# EAGLE design passive_A-B_box (EAGLE 6.2)
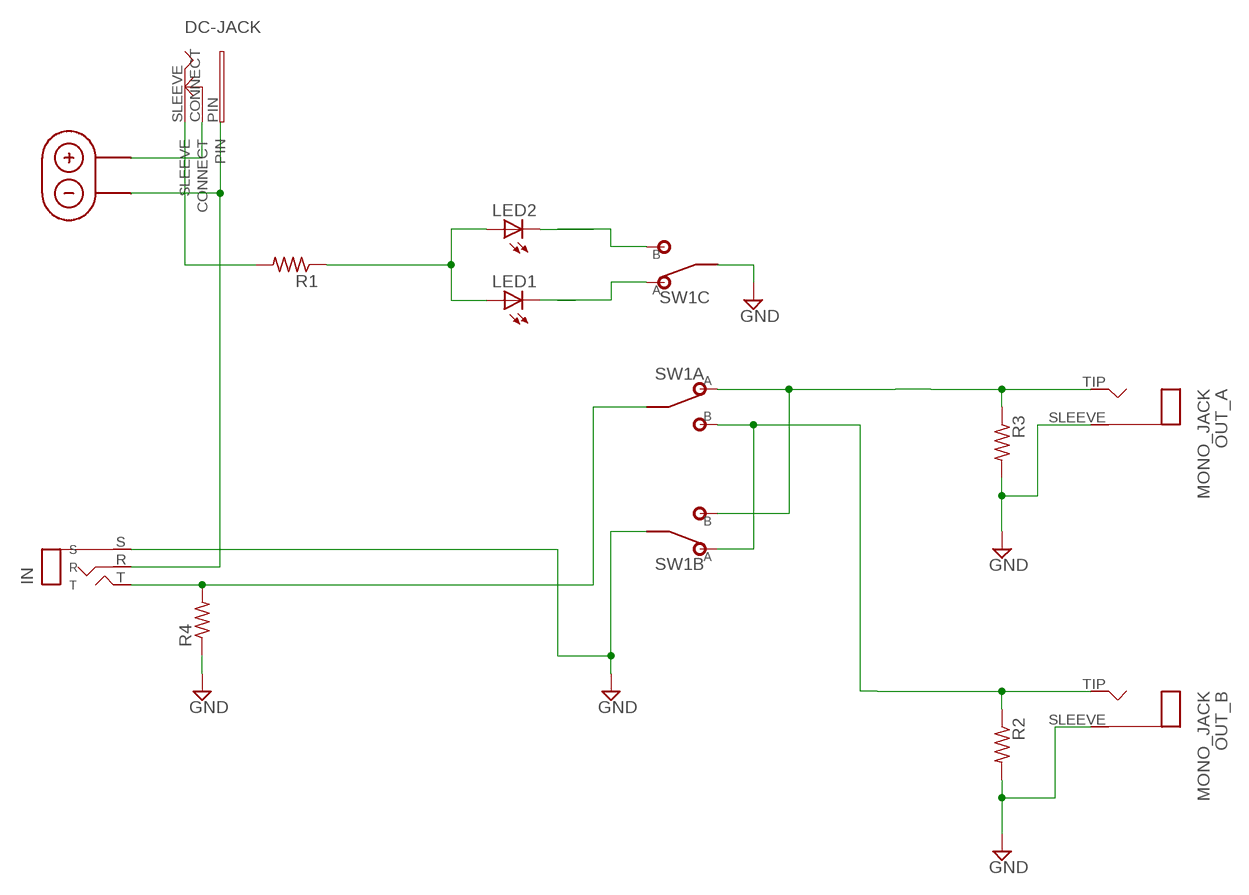
[diagram p0: schematic, sheet 1]

## Parts
DC-JACK  DC_JACK  DC_JACK_OFFBOARD  [DC_JACK_OFFBOARD]
IN  STEREO_JACK  [STEREO_JACK]
LED1  LED5MM  [LED5MM]
LED2  LED5MM  [LED5MM]
OUT_A  MONO_JACK  [MONO_JACK]
OUT_B  MONO_JACK  [MONO_JACK]
R1  RESISTOR  [RESISTOR]
R2  RESISTOR  [RESISTOR]
R3  RESISTOR  [RESISTOR]
R4  RESISTOR  [RESISTOR]
SW1  3PDT  [3PDT]
U$4  9V_BATTERY_CLIP  [9V_BATTERY]

## Nets
DC-JACK: DC-JACK.CONNECT U$4.9V_BATTERY_+
GND: IN.S OUT_A.SLEEVE OUT_B.SLEEVE R2.2 R3.2 R4.1 SW1.B2(B:COM) SW1.C2(C:COM)
N$1: IN.T R4.2 SW1.A2(A:COM)
N$4: DC-JACK.SLEEVE R1.2
N$5: LED1.K(C) SW1.C1(C:A)
N$7: LED2.K(C) SW1.C3(C:B)
N$8: LED1.A LED2.A R1.1
N$9: OUT_A.TIP R3.1 SW1.A1(A:A) SW1.B3(B:B)
N$10: OUT_B.TIP R2.1 SW1.A3(A:B) SW1.B1(B:A)
N$12: DC-JACK.PIN IN.R U$4.9V_BATTERY_-

## Library data of the parts
DC-JACK = 00_steve:DC_JACK_OFFBOARD
IN = 00_steve:STEREO_JACK
LED1 LED2 = SparkFun:LED: LEDs Standard schematic elements and footprints for 5mm, 3mm, 1206, and 0603 sized LEDs. 5mm - Spark Fun Electronics SKU : COM-00529 (and others)
OUT_A OUT_B = 00_steve:MONO_JACK
R1-R4 = 00_steve:RESISTOR
SW1 = 00_steve:3PDT
U$4 = 00_steve:9V_BATTERY_CLIP

## Board
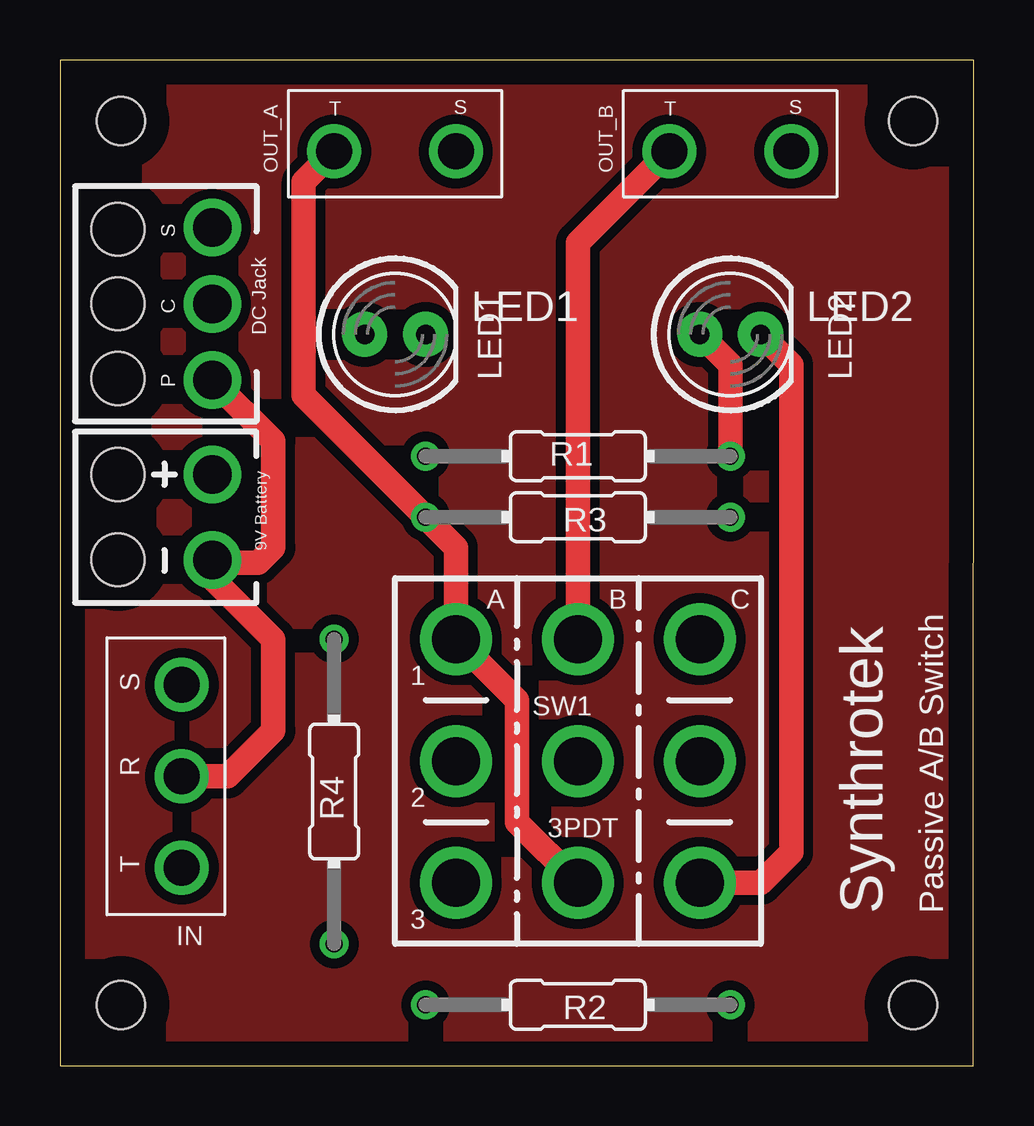
[diagram p1: board, top side]
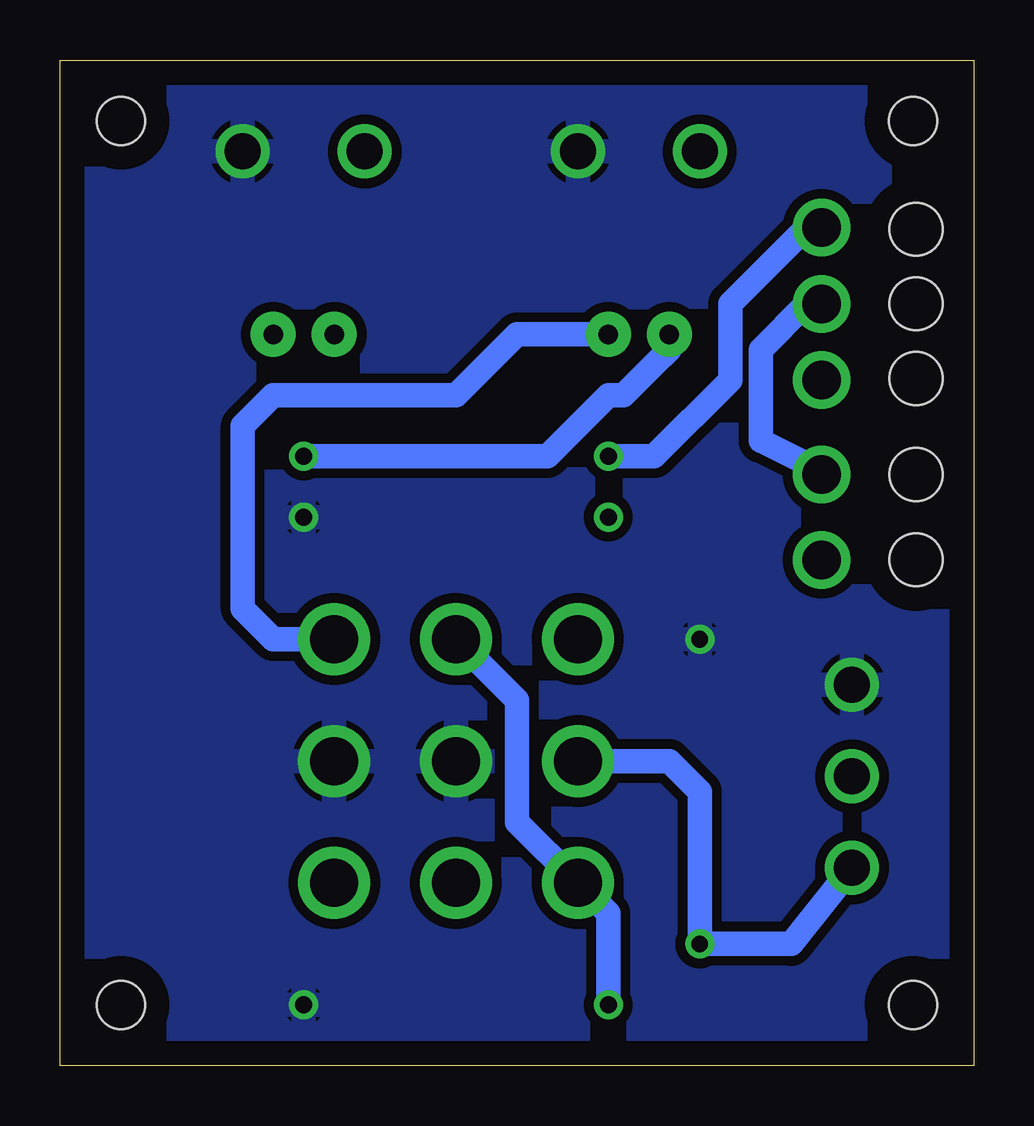
[diagram p2: board, bottom side, seen from below]

Size 38.1 x 41.91 mm. Coordinates in mm from the lower left corner, seen from the top.
Outline: 0,0 38.08,0 38.1,41.91 0,41.91 0,0
Copper layers (1*16): Top 0.035mm / dielectric 1.5mm / Bottom 0.035mm
Design rules: minimum track width 10mil, minimum drill 24mil, track to track 8mil, track to pad 8mil, pad to pad 8mil, via to via 8mil, smd to smd 8mil, copper to edge 40mil, drill to drill 8mil, minimum pad ring 10mil, minimum via ring 8mil, stop-mask expansion 4mil, vias tented up to drill 0mil, thermal gap 10mil
Holes 2 mm at 2.54,2.54 35.56,2.54 35.56,39.37 2.54,39.37

### Footprints (pad centres in the part's own frame; a part is rotated, then mirrored left to right if it is on the bottom)
DC_JACK_OFFBOARD = drill 1.6: CONNECT 0,1.27; PIN 3.175,1.27; SLEEVE -3.175,1.27 | hole 2.2: -3.111,-2.667; 0,-2.667; 3.111,-2.667
STEREO_JACK = drill 1.5: R 0,0; S 3.81,0; T -3.81,0
LED5MM = drill 0.813 pad 1.88: A -1.27,0; K 1.27,0
MONO_JACK = drill 1.5: SLEEVE 2.54,0; TIP -2.54,0
RESISTOR = drill 0.7: 1 -6.35,0; 2 6.35,0
3PDT = drill 2: A1 -5.08,5.08; A2 -5.08,0; A3 -5.08,-5.08; B1 0,5.08; B2 0,0; B3 0,-5.08; C1 5.08,5.08; C2 5.08,0; C3 5.08,-5.08
9V_BATTERY = drill 1.6: 9V_BATTERY_+ -1.778,1.27; 9V_BATTERY_- 1.778,1.27 | hole 2.2: -1.778,-2.667; 1.778,-2.667

### Placement (x,y rotation side)
DC-JACK  5.08,31.75 270 top
IN  5.08,12.06 90 top
LED1  13.97,30.48 0 top
LED2  27.94,30.48 0 top
OUT_A  13.97,38.1 0 top
OUT_B  27.94,38.1 0 top
R1  21.59,25.4 180 top
R2  21.59,2.54 0 top
R3  21.59,22.86 0 top
R4  11.43,11.43 270 top
SW1  21.59,12.7 0 top
U$4  5.08,22.86 270 top

### Tracks (layer width: path | path; a pad name or v marks a point on that pad's centre or on a via)
DC-JACK
  Bottom 1.016: DC-JACK.CONNECT 6.99,31.75 8.89,29.84 8.89,26.04 6.35,24.77 6.48,24.77 U$4.9V_BATTERY_+
GND
  pour Bottom (isolate 0.406): 0,41.91 38.1,41.91 38.1,0 0,0
N$1
  Bottom 1.016: IN.T 7.62,5.08 R4.2 11.43,11.43 12.7,12.7 SW1.A2
N$2
  pour Top (isolate 0.406): 0,41.91 38.1,41.91 38.1,0 0,0
  pour Top (isolate 0.406): 0,41.91 38.1,41.91 38.1,0 0,0
N$4
  Bottom 1.016: DC-JACK.SLEEVE 6.99,34.92 10.16,31.75 10.16,28.57 13.34,25.4 R1.2
N$5
  Bottom 1.016: LED1.K 19.05,30.48 21.59,27.94 29.21,27.94 30.48,26.67 30.48,19.05 29.21,17.78 SW1.C1
N$7
  Top 1.016: SW1.C3 29.21,7.62 30.48,8.89 30.48,29.21 LED2.K
N$8
  Top 1.016: R1.1 27.94,29.21 LED2.A
  Bottom 1.016: R1.1 17.78,25.4 15.24,27.94 14.61,27.94 13.34,29.21 12.7,29.84 LED1.A
N$9
  Top 1.016: SW1.B3 19.05,10.16 19.05,15.24 18.41,15.88 SW1.A1 16.51,21.59 R3.1 10.16,27.94 10.16,36.83 OUT_A.TIP
N$10
  Top 1.016: SW1.B1 21.59,34.29 OUT_B.TIP
  Bottom 1.016: R2.1 15.24,6.35 SW1.A3 19.05,10.16 19.05,15.24 SW1.B1
N$12
  Top 1.016: DC-JACK.PIN 8.89,26.04 8.89,21.59 8.26,20.95 6.48,20.95 U$4.9V_BATTERY_- 6.35,20.32 8.89,17.78 8.89,13.97 8.26,13.34 6.99,12.06 IN.R

### Text on the board
tPlace: LED1 | LED2 | Synthrotek | Passive A/B Switch